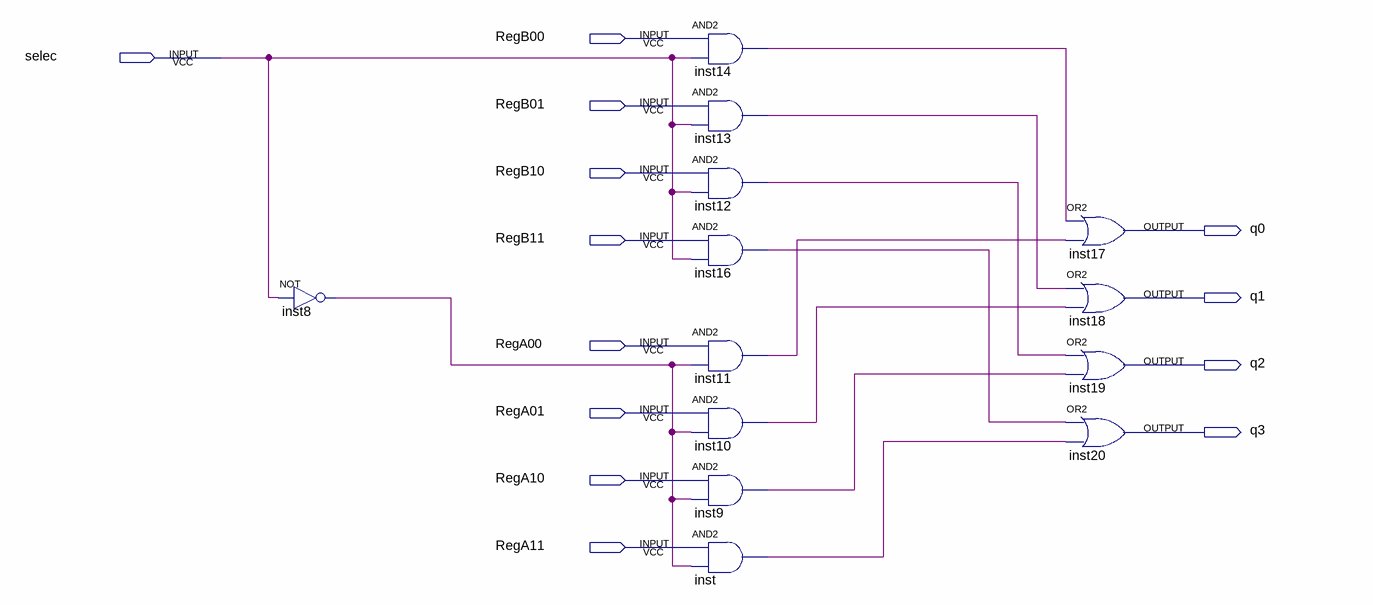
[diagram p0: schematic sheet]
// Quartus schematic RegSelector.bdf as structural Verilog: 13 symbols, 13 pins
module RegSelector (
  input  RegB00,
  input  selec,
  input  RegB01,
  input  RegB10,
  input  RegB11,
  input  RegA00,
  input  RegA01,
  input  RegA10,
  input  RegA11,
  output q0,
  output q1,
  output q2,
  output q3
);

  wire inst8_out, inst9_out, inst10_out, inst11_out, inst12_out, inst13_out, inst14_out, inst16_out, inst_out;

  not inst8 (inst8_out, selec);
  and inst14 (inst14_out, RegB00, selec);
  and inst13 (inst13_out, RegB01, selec);
  and inst12 (inst12_out, RegB10, selec);
  and inst16 (inst16_out, RegB11, selec);
  and inst11 (inst11_out, RegA00, inst8_out);
  and inst10 (inst10_out, RegA01, inst8_out);
  and inst9 (inst9_out, RegA10, inst8_out);
  and inst (inst_out, RegA11, inst8_out);
  or inst17 (q0, inst14_out, inst11_out);
  or inst18 (q1, inst13_out, inst10_out);
  or inst19 (q2, inst12_out, inst9_out);
  or inst20 (q3, inst16_out, inst_out);
endmodule
